# Altium project PLC_DIY.PrjPcb
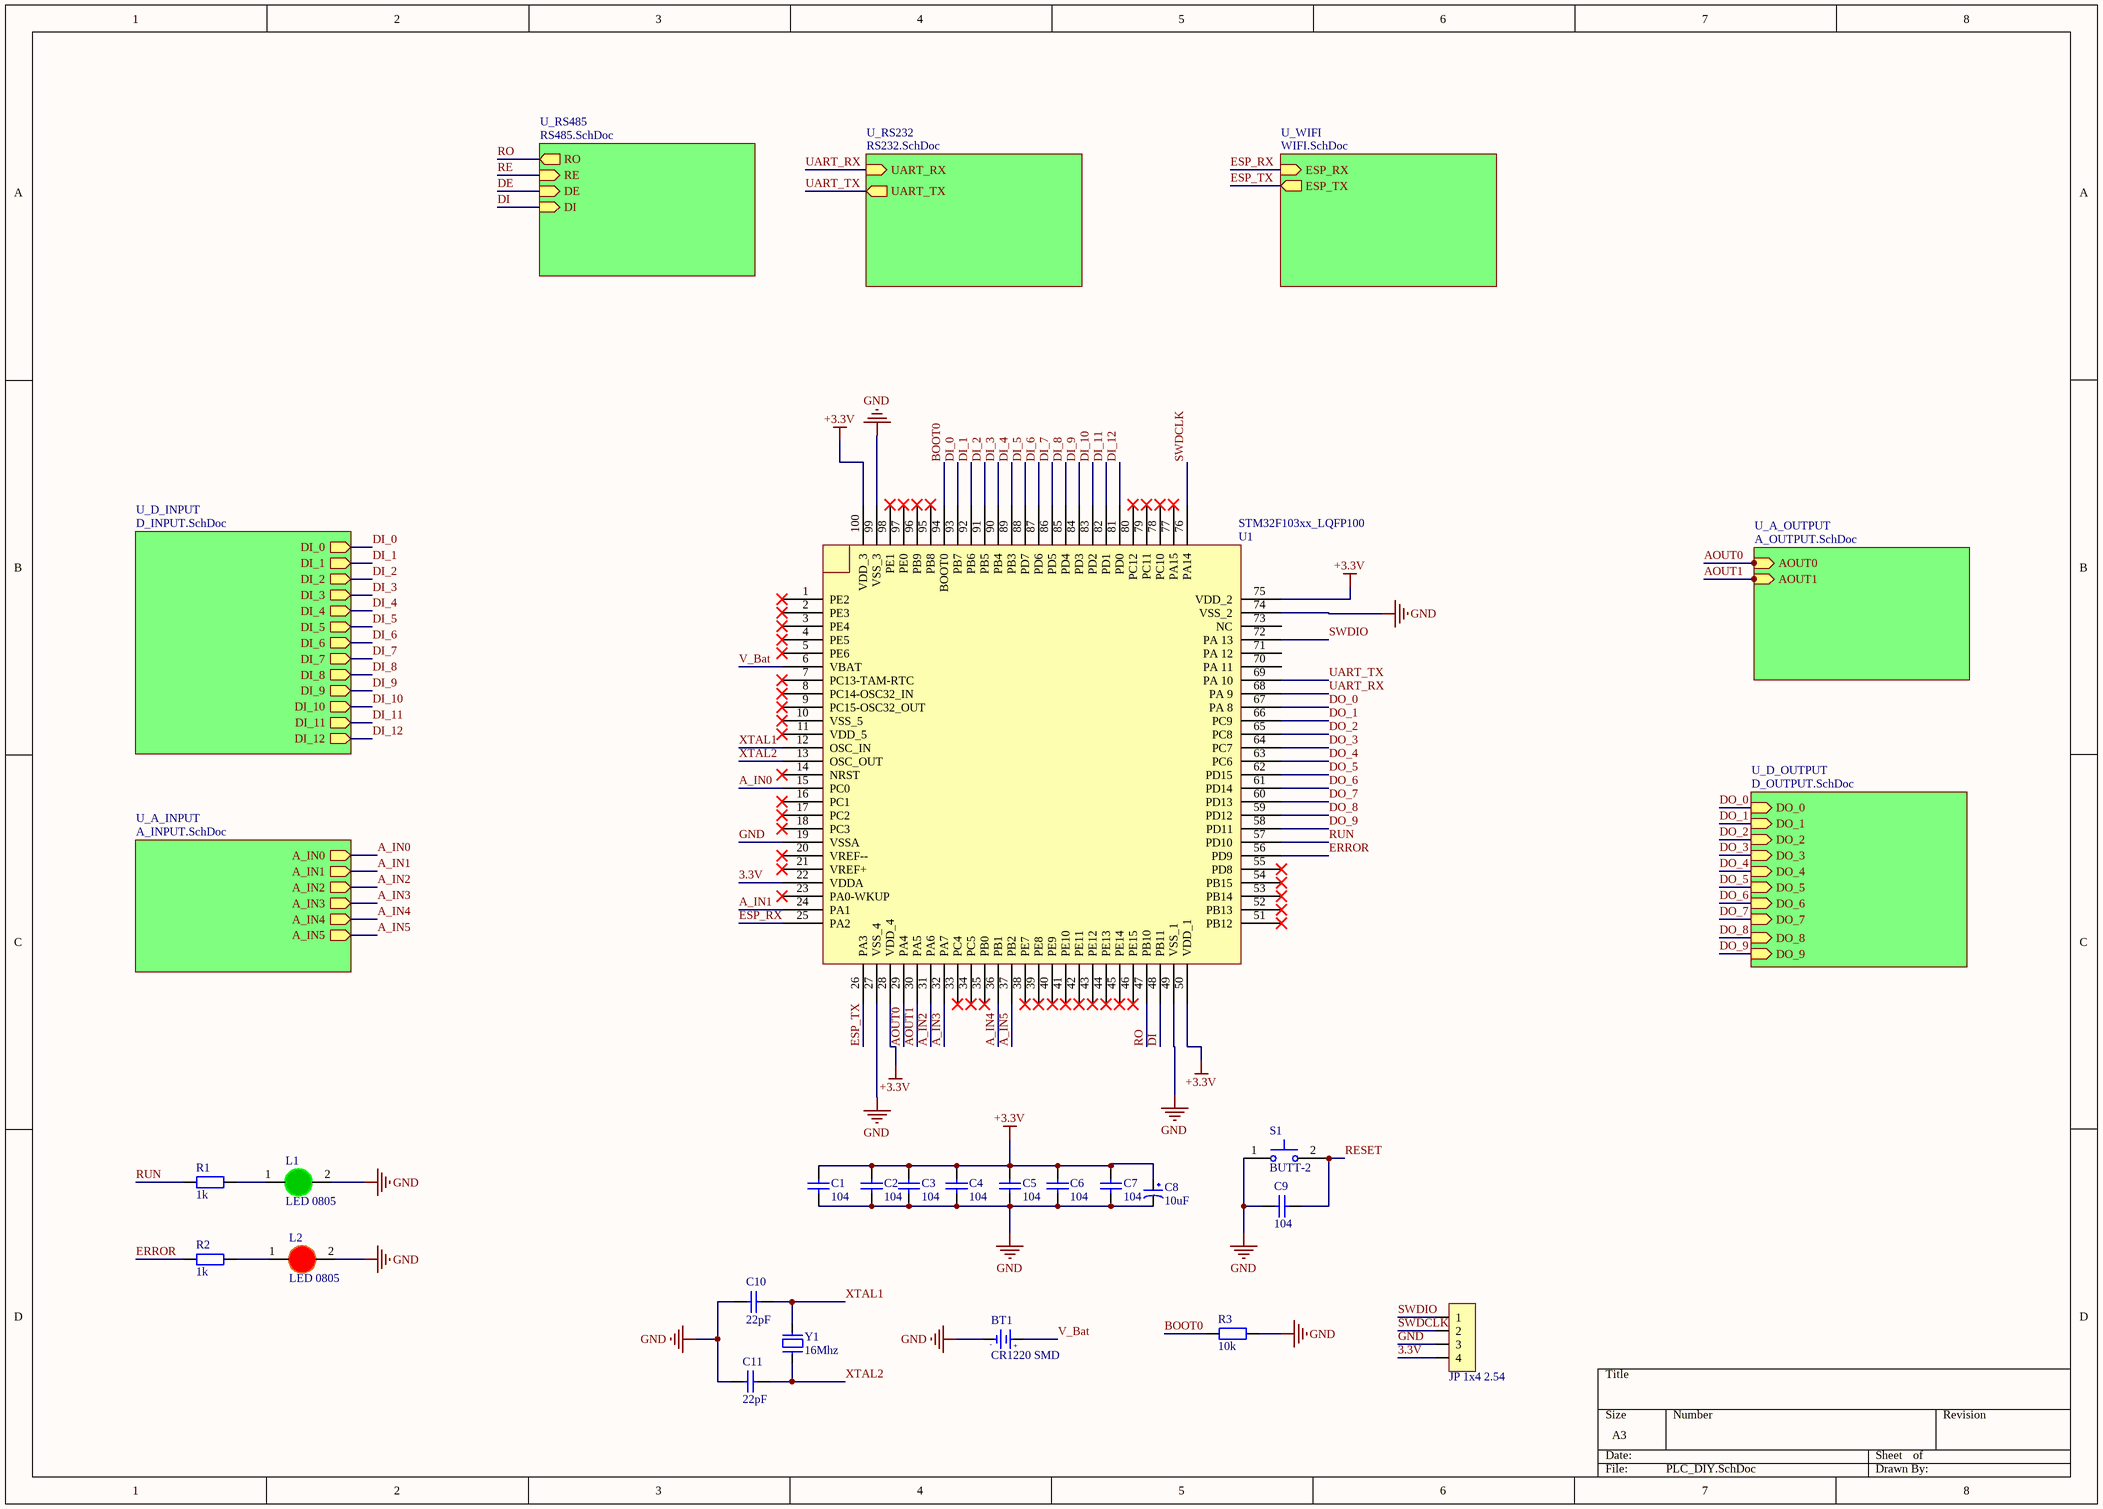
[diagram p0: PLC_DIY.SchDoc]
10 sheets, 178 parts. Net scope: hierarchical (ports join the sheet entries above them; power ports are global).
Board file: PLC_DIY.PcbDoc
Sheets:
  PLC_DIY.SchDoc
    U_A_INPUT = A_INPUT.SchDoc
    U_D_INPUT = D_INPUT.SchDoc
    U_A_OUTPUT = A_OUTPUT.SchDoc
    U_D_OUTPUT = D_OUTPUT.SchDoc
    U_RS232 = RS232.SchDoc
    U_RS485 = RS485.SchDoc
    U_WIFI = WIFI.SchDoc
  PWM_OUTPUT.SchDoc
  KHOI_NGUON.SchDoc

## Sheet PLC_DIY.SchDoc: PLC_DIY
size A3; DocumentNumber: 1; SheetNumber: 1; SheetTotal: 10

### Parts
BT1  CR1220 SMD  [DE PIN CR1220]
C1  104  [tu 0805]
C2  104  [tu 0805]
C3  104  [tu 0805]
C4  104  [tu 0805]
C5  104  [tu 0805]
C6  104  [tu 0805]
C7  104  [tu 0805]
C8  10uF  [tu tantalum smd3528]
C9  104  [tu 0805]
C10  22pF  [tu 0805]
C11  22pF  [tu 0805]
JP1  JP 1x4 2.54  [JP 1x4 DC]
L1  LED 0805  [LED-0805-Green]
L2  LED 0805  [LED-0805-Red]
R1  1k  [tro smd 0805]
R2  1k  [tro smd 0805]
R3  10k  [tro smd 0805]
S1  BUTT-2  [SW_BUTT-2]
U1  STM32F103xx_LQFP100  [STM32_LQFP100]
Y1  16Mhz  [Thach Anh 2 chan SMD]

### Sub-sheets
U_A_INPUT = A_INPUT.SchDoc: A_IN0 (out), A_IN1 (out), A_IN2 (out), A_IN3 (out), A_IN4 (out), A_IN5 (out)
U_A_OUTPUT = A_OUTPUT.SchDoc: AOUT0 (in), AOUT1 (in)
U_D_INPUT = D_INPUT.SchDoc: DI_0 (out), DI_1 (out), DI_2 (out), DI_3 (out), DI_4 (out), DI_5 (out), DI_6 (out), DI_7 (out), DI_8 (out), DI_9 (out), DI_10 (out), DI_11 (out), DI_12 (out)
U_D_OUTPUT = D_OUTPUT.SchDoc: DO_0 (in), DO_1 (in), DO_2 (in), DO_3 (in), DO_4 (in), DO_9 (in), DO_5 (in), DO_6 (in), DO_7 (in), DO_8 (in)
U_RS232 = RS232.SchDoc: UART_TX (out), UART_RX (in)
U_RS485 = RS485.SchDoc: RO (out), RE (in), DE (in), DI (in)
U_WIFI = WIFI.SchDoc: ESP_TX (out), ESP_RX (in)

### Nets
+3.3V: C1.1 C2.1 C3.1 C4.1 C5.1 C6.1 C7.1 C8.1 U1.28(VDD_4) U1.50(VDD_1) U1.75(VDD_2) U1.100(VDD_3)
GND: BT1.2(GND) C1.2 C2.2 C3.2 C4.2 C5.2 C6.2 C7.2 C8.2 C9.1 C10.2 C11.2 JP1.3 L1.2(K) L2.2(K) R3.2 S1.1 U1.19(VSSA) U1.27(VSS_4) U1.49(VSS_1) U1.74(VSS_2) U1.99(VSS_3)
3.3V: JP1.4 U1.22(VDDA)
A_IN0: U1.15(PC0) ; sheet U_A_INPUT/A_IN0
A_IN1: U1.24(PA1) ; sheet U_A_INPUT/A_IN1
A_IN2: U1.31(PA6) ; sheet U_A_INPUT/A_IN2
A_IN3: U1.32(PA7) ; sheet U_A_INPUT/A_IN3
A_IN4: U1.36(PB1) ; sheet U_A_INPUT/A_IN4
A_IN5: U1.37(PB2) ; sheet U_A_INPUT/A_IN5
AOUT0: U1.29(PA4) ; sheet U_A_OUTPUT/AOUT0
AOUT1: U1.30(PA5) ; sheet U_A_OUTPUT/AOUT1
BOOT0: R3.1 U1.94(BOOT0)
DE: U1.47(PB10) U1.48(PB11) ; sheet U_RS485/RO, sheet U_RS485/RE, sheet U_RS485/DE, sheet U_RS485/DI  [also labelled DI, RE, RO]
DI_0: U1.93(PB7) ; sheet U_D_INPUT/DI_0
DI_1: U1.92(PB6) ; sheet U_D_INPUT/DI_1
DI_2: U1.91(PB5) ; sheet U_D_INPUT/DI_2
DI_3: U1.90(PB4) ; sheet U_D_INPUT/DI_3
DI_4: U1.89(PB3) ; sheet U_D_INPUT/DI_4
DI_5: U1.88(PD7) ; sheet U_D_INPUT/DI_5
DI_6: U1.87(PD6) ; sheet U_D_INPUT/DI_6
DI_7: U1.86(PD5) ; sheet U_D_INPUT/DI_7
DI_8: U1.85(PD4) ; sheet U_D_INPUT/DI_8
DI_9: U1.84(PD3) ; sheet U_D_INPUT/DI_9
DI_10: U1.83(PD2) ; sheet U_D_INPUT/DI_10
DI_11: U1.82(PD1) ; sheet U_D_INPUT/DI_11
DI_12: U1.81(PD0) ; sheet U_D_INPUT/DI_12
DO_0: U1.67(PA_8) ; sheet U_D_OUTPUT/DO_0
DO_1: U1.66(PC9) ; sheet U_D_OUTPUT/DO_1
DO_2: U1.65(PC8) ; sheet U_D_OUTPUT/DO_2
DO_3: U1.64(PC7) ; sheet U_D_OUTPUT/DO_3
DO_4: U1.63(PC6) ; sheet U_D_OUTPUT/DO_4
DO_5: U1.62(PD15) ; sheet U_D_OUTPUT/DO_5
DO_6: U1.61(PD14) ; sheet U_D_OUTPUT/DO_6
DO_7: U1.60(PD13) ; sheet U_D_OUTPUT/DO_7
DO_8: U1.59(PD12) ; sheet U_D_OUTPUT/DO_8
DO_9: U1.58(PD11) ; sheet U_D_OUTPUT/DO_9
ERROR: R2.1 U1.56(PD9)
ESP_RX: U1.25(PA2) ; sheet U_WIFI/ESP_RX
ESP_TX: U1.26(PA3) ; sheet U_WIFI/ESP_TX
RESET: C9.2 S1.2
RUN: R1.1 U1.57(PD10)
SWDCLK: JP1.2 U1.76(PA14)
SWDIO: JP1.1 U1.72(PA_13)
UART_RX: U1.68(PA_9) ; sheet U_RS232/UART_RX
UART_TX: U1.69(PA_10) ; sheet U_RS232/UART_TX
V_Bat: BT1.1(+3V) U1.6(VBAT)
XTAL1: C10.1 U1.12(OSC_IN) Y1.2
XTAL2: C11.1 U1.13(OSC_OUT) Y1.1
NetL1_1: L1.1(A) R1.2
NetL2_1: L2.1(A) R2.2

Not connected (* = marked no-connect by the designer): U1 1(PE2)* 2(PE3)* 3(PE4)* 4(PE5)* 5(PE6)* 7(PC13-TAM-RTC)* 8(PC14-OSC32_IN)* 9(PC15-OSC32_OUT)* 10(VSS_5)* 11(VDD_5)* 14(NRST)* 16(PC1)* 17(PC2)* 18(PC3)* 20(VREF--)* 21(VREF+)* 23(PA0-WKUP)* 33(PC4)* 34(PC5)* 35(PB0)* 38(PE7)* 39(PE8)* 40(PE9)* 41(PE10)* 42(PE11)* 43(PE12)* 44(PE13)* 45(PE14)* 46(PE15)* 51(PB12)* 52(PB13)* 53(PB14)* 54(PB15)* 55(PD8)* 70(PA_11) 71(PA_12) 73(NC) 77(PA15)* 78(PC10)* 79(PC11)* 80(PC12)* 95(PB8)* 96(PB9)* 97(PE0)* 98(PE1)*

### Notes on the sheet
- (in symbol De pin CR1220 SMD) -; +

### Library data of the parts
BT1 = De pin CR1220 SMD: Ten: Đế PIN CR1220 SMD; Ma_Hang: MH000833
C1-C7 C9 = Tu 0805 104 50V 10%: Dán; Don_Vi: Con; So_Chan: 2; Ten_Linh_Kien: Tụ 0805 104-100nF 10% 50V; Ma_Hang: MH004551; Chung_Loai: Dán; Kieu_Chan: *
C8 = Tu tantalum 10uF 16V SMD3528: Dán; Don_Vi: Con; So_Chan: 2; Ten_Linh_Kien: Tụ tantalum 106C-10uF 16V SMD3528; Ma_Hang: MH007474; Chung_Loai: Dán; Kieu_Chan: *
C10 C11 = Tu 0805 22pF 50V 10%: Dán; Don_Vi: Con; So_Chan: 2; Ten_Linh_Kien: Tụ 0805 22P 10% 50V; Ma_Hang: MH004560; Chung_Loai: Dán; Kieu_Chan: *
JP1 = JP 1x4 2.54 Duc Cong: Cắm; Ten_Linh_Kien: Jump Đơn Đực 2.54MM 1x40P Cong Đứng; Don_Vi: Con; Ma_Hang: MH000904; Ghi_Chu: *; Kieu_Chan: *; Chung_Loai: Cắm
L1 = LED 0805 Xanh La: Dán; Don_Vi: Con; Ma_Hang: MH002326; Ten_Linh_Kien: LED 0805 Màu Xanh Lá (Green); Ghi_Chu: *; Kieu_Chan: *; Chung_Loai: Dán
L2 = LED 0805 Do: Dán; Don_Vi: Con; Ma_Hang: MH000897; Ten_Linh_Kien: LED 0805 Màu Đỏ (Red); Ghi_Chu: *; Kieu_Chan: *; Chung_Loai: Dán
R1 R2 = Tro 0805 1% 1k: Dán; Don_Vi: Con; So_Chan: 2; Ten_Linh_Kien: Trở 0805 1% 1k; Ma_Hang: MH005468; Chung_Loai: Dán; Kieu_Chan: *
R3 = Tro 0805 1% 10k: Dán; Don_Vi: Con; So_Chan: 2; Ten_Linh_Kien: Trở 0805 1% 10k; Ma_Hang: MH005473; Chung_Loai: Dán; Kieu_Chan: *
S1 = BUTT-2: Tactile Switches MINI PUSH BUTTON SWITCH 2-PIN QTY. 4; MF: Gravitech; Purchase-URL: https://pricing.snapeda.com/search/part/BUTT-2/?ref=eda; Package: None; Value: *; Check_prices: https://www.snapeda.com/parts/BUTT-2/Gravitech/view-part/?ref=eda; SnapEDA_Link: https://www.snapeda.com/parts/BUTT-2/Gravitech/view-part/?ref=snap; Availability: In Stock; Price: None; MP: BUTT-2
Y1 = Thach Anh 2 chan SMD: Crystal For all Crystal 2pin.; Value: 4Mhz

## Sheet A_INPUT.SchDoc
size A3; SheetNumber: 3; SheetTotal: 10
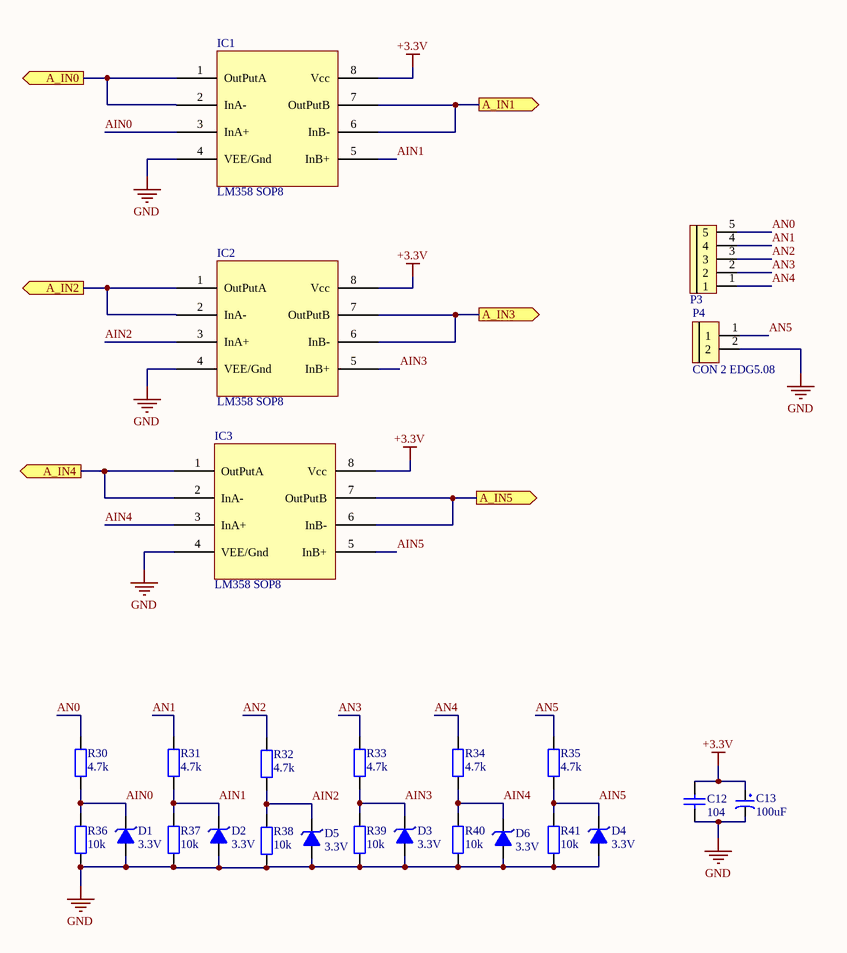
[diagram p1: A_INPUT.SchDoc]

### Parts
C12  104  [tu 0805]
C13  100uF  [tu hoa 5mm]
D1  3.3V  [DIODE ZENNER SMD SOD80]
D2  3.3V  [DIODE ZENNER SMD SOD80]
D3  3.3V  [DIODE ZENNER SMD SOD80]
D4  3.3V  [DIODE ZENNER SMD SOD80]
D5  3.3V  [DIODE ZENNER SMD SOD80]
D6  3.3V  [DIODE ZENNER SMD SOD80]
IC1  LM358 SOP8  [SOP 8]
IC2  LM358 SOP8  [SOP 8]
IC3  LM358 SOP8  [SOP 8]
P3  CON 5 EDG5.08  [CON 5 5EDG5.08]  (value not drawn)
P4  CON 2 EDG5.08  [CON 2 2EDG5.08]
R30  4.7k  [tro smd 0805]
R31  4.7k  [tro smd 0805]
R32  4.7k  [tro smd 0805]
R33  4.7k  [tro smd 0805]
R34  4.7k  [tro smd 0805]
R35  4.7k  [tro smd 0805]
R36  10k  [tro smd 0805]
R37  10k  [tro smd 0805]
R38  10k  [tro smd 0805]
R39  10k  [tro smd 0805]
R40  10k  [tro smd 0805]
R41  10k  [tro smd 0805]

### Ports
A_IN0 (out), A_IN1 (out), A_IN2 (out), A_IN3 (out), A_IN4 (out), A_IN5 (out)

### Nets
+3.3V: C12.1 C13.1 IC1.8(Vcc) IC2.8(Vcc) IC3.8(Vcc)
GND: C12.2 C13.2 D1.1(A) D2.1(A) D3.1(A) D4.1(A) D5.1(A) D6.1(A) IC1.4(VEE/Gnd) IC2.4(VEE/Gnd) IC3.4(VEE/Gnd) P4.2 R36.1 R37.1 R38.1 R39.1 R40.1 R41.1
A_IN0: IC1.1(OutPutA) IC1.2(InA-) ; port A_IN0
A_IN1: IC1.6(InB-) IC1.7(OutPutB) ; port A_IN1
A_IN2: IC2.1(OutPutA) IC2.2(InA-) ; port A_IN2
A_IN3: IC2.6(InB-) IC2.7(OutPutB) ; port A_IN3
A_IN4: IC3.1(OutPutA) IC3.2(InA-) ; port A_IN4
A_IN5: IC3.6(InB-) IC3.7(OutPutB) ; port A_IN5
AIN0: D1.2(K) IC1.3(InA+) R30.1 R36.2
AIN1: D2.2(K) IC1.5(InB+) R31.1 R37.2
AIN2: D5.2(K) IC2.3(InA+) R32.1 R38.2
AIN3: D3.2(K) IC2.5(InB+) R33.1 R39.2
AIN4: D6.2(K) IC3.3(InA+) R34.1 R40.2
AIN5: D4.2(K) IC3.5(InB+) R35.1 R41.2
AN0: P3.5 R30.2
AN1: P3.4 R31.2
AN2: P3.3 R32.2
AN3: P3.2 R33.2
AN4: P3.1 R34.2
AN5: P4.1 R35.2

### Library data of the parts
C12 = Tu 0805 104 50V 10%: as C1 on sheet PLC_DIY; Chung_Loai: Dán; Kieu_Chan: *
C13 = Tu Hoa 100uF 16V 5x7: Cắm; Don_Vi: Con; So_Chan: 2; Ten_Linh_Kien: Tụ Hóa 100uF 16V 5x7MM; Ma_Hang: MH001347; Chung_Loai: Cắm; Kieu_Chan: *
D1-D6 = Diode Zener 3.3V: Dán; Don_Vi: Con; Ma_Hang: MH002880; Ten_Linh_Kien: Diode Zener 1/2W 3.3V SMD1206 ZMM3.3; Kieu_Chan: *; Ghi_Chu: *; Chung_Loai: Dán
IC1-IC3 = LM358 SOP8: Dán; Ma_Hang: MH000609; Don_Vi: Con; Ten_Linh_Kien: LM358 SOP8; Kieu_Chan: *; Ghi_Chu: *; Chung_Loai: Dán
P3 = CON 5 EDG5.08: Cắm; Ten_Linh_Kien: CON 5 2EDG5.08-5P 5.08MM ( Xanh Cong); Ma_Hang: MH003589; Kieu_Chan: *; Don_Vi: Con; Ghi_Chu: *; Chung_Loai: Cắm
P4 = CON 2 EDG5.08: Cắm; Ten_Linh_Kien: CON 2 2EDG5.08-2P 5.08MM ( Xanh Cong); Ma_Hang: MH000759; Ghi_Chu: *; Don_Vi: Con; Kieu_Chan: *; Chung_Loai: Cắm
R30-R35 = Tro 0805 1% 5.1k: Dán; Don_Vi: Con; So_Chan: 2; Ten_Linh_Kien: Trở 0805 1% 5.1k; Ma_Hang: MH008812; Chung_Loai: Dán; Kieu_Chan: *
R36-R41 = Tro 0805 1% 10k: as R3 on sheet PLC_DIY; Chung_Loai: Dán; Kieu_Chan: *

## Sheet D_INPUT.SchDoc
size A3; SheetNumber: 2; SheetTotal: 10
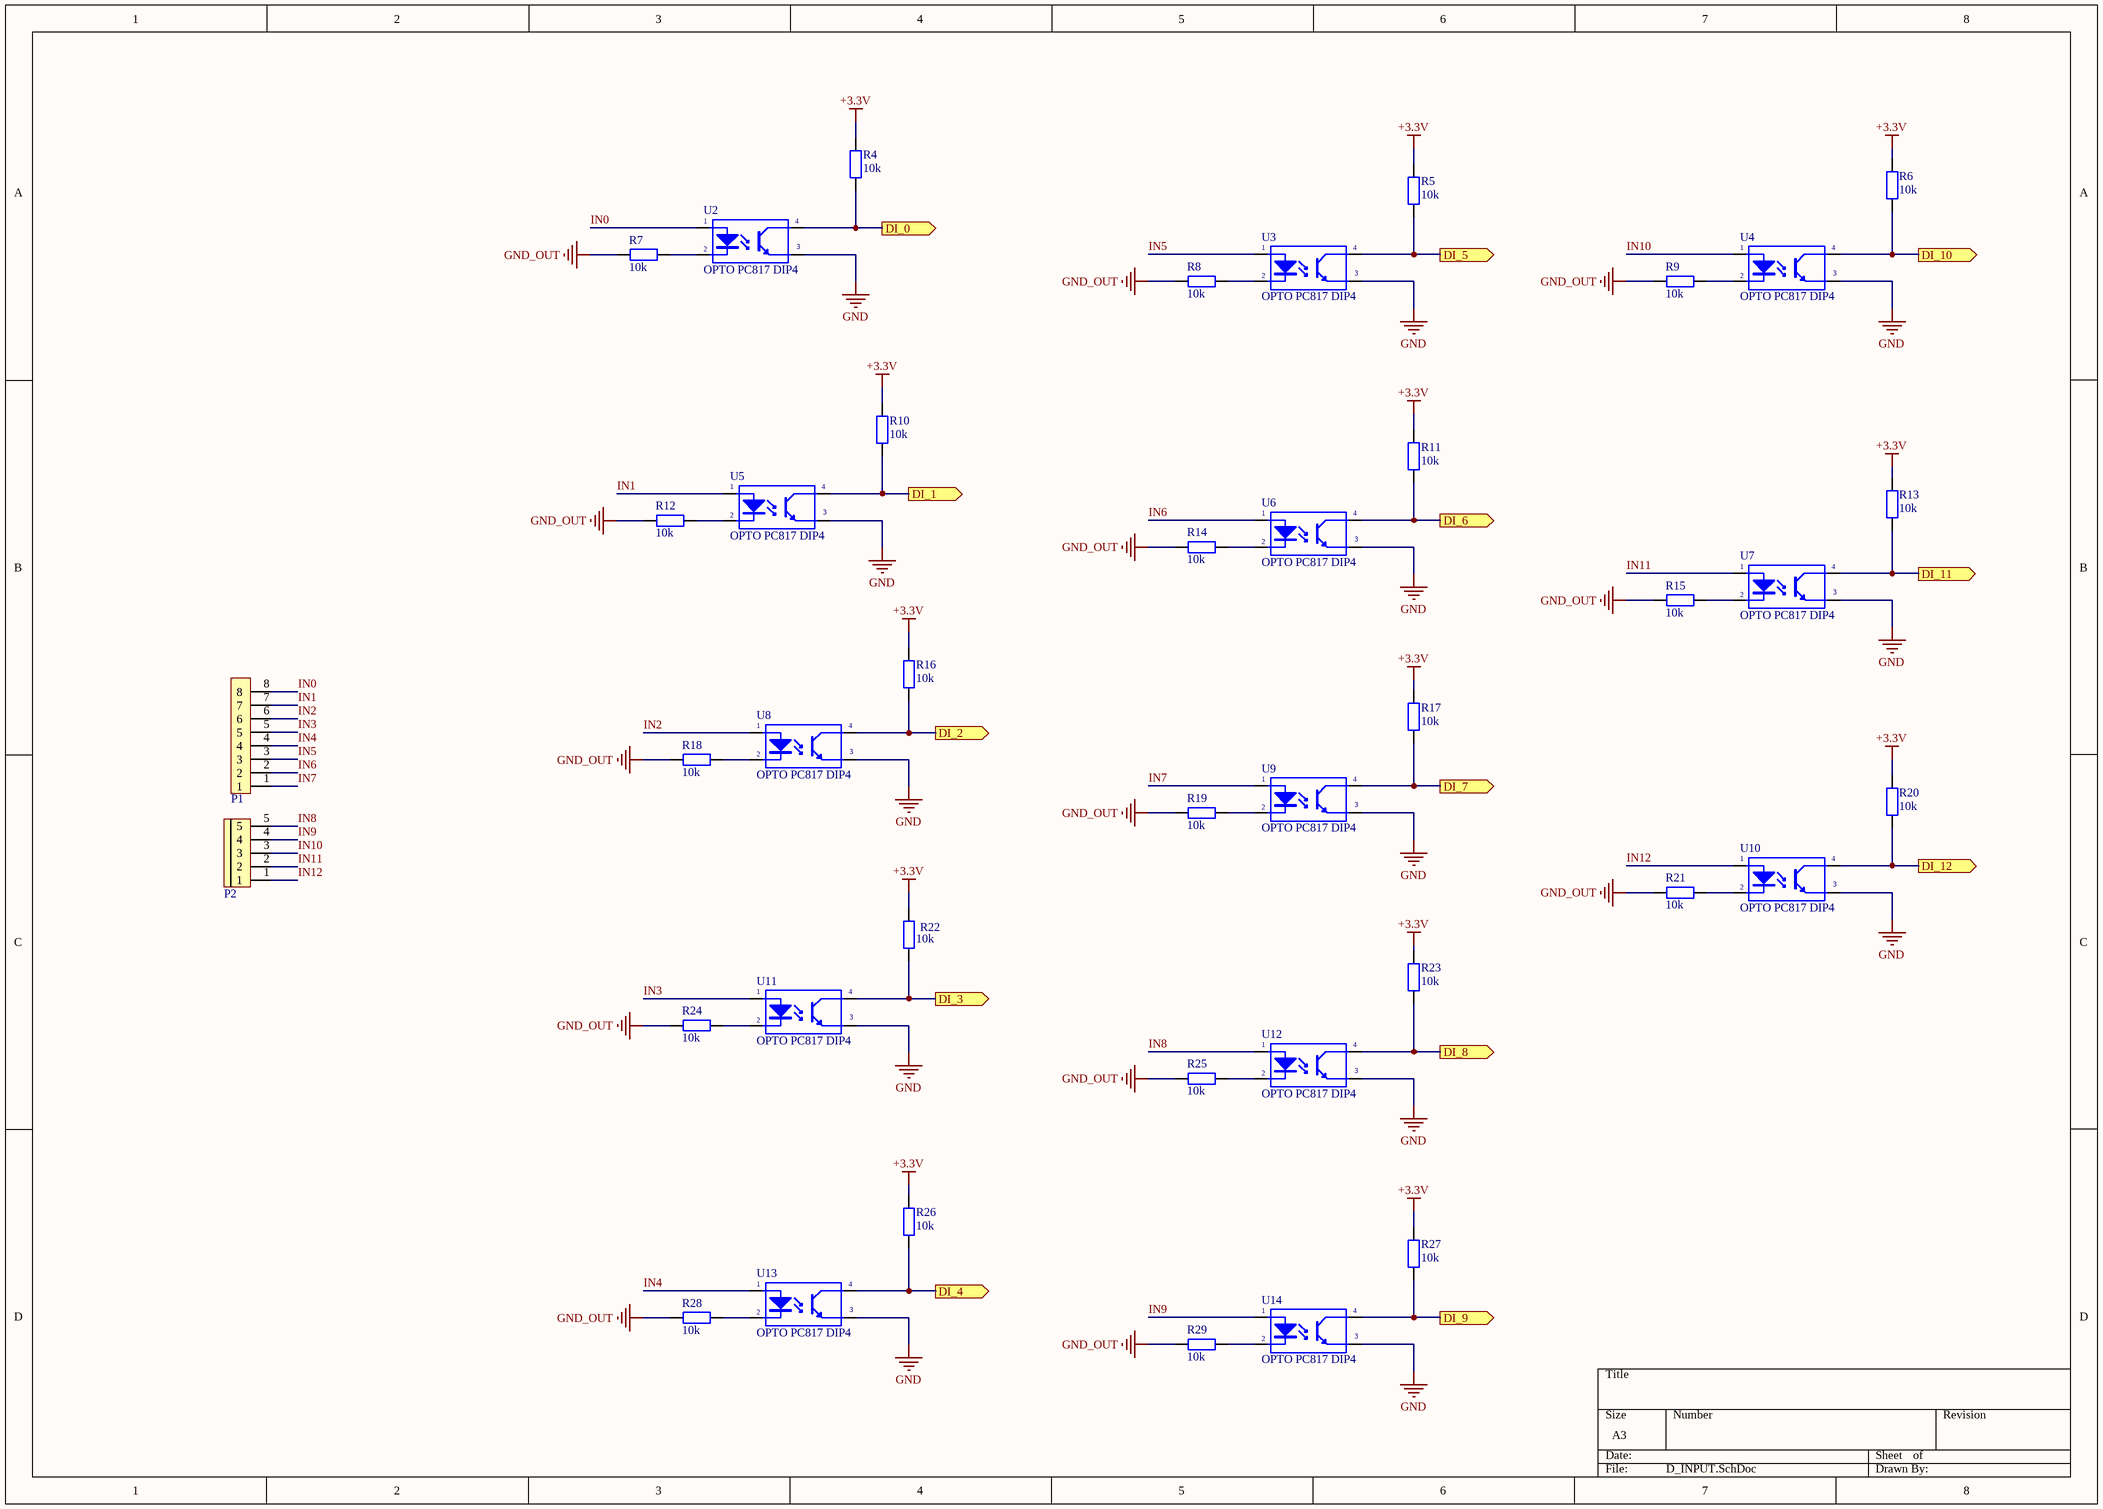
[diagram p2: D_INPUT.SchDoc]

### Parts
P1  CON 8 EDG5.08  [CON 8 8EDG5.08]  (value not drawn)
P2  CON 5 EDG5.08  [CON 5 5EDG5.08]  (value not drawn)
R4  10k  [tro smd 0805]
R5  10k  [tro smd 0805]
R6  10k  [tro smd 0805]
R7  10k  [tro smd 0805]
R8  10k  [tro smd 0805]
R9  10k  [tro smd 0805]
R10  10k  [tro smd 0805]
R11  10k  [tro smd 0805]
R12  10k  [tro smd 0805]
R13  10k  [tro smd 0805]
R14  10k  [tro smd 0805]
R15  10k  [tro smd 0805]
R16  10k  [tro smd 0805]
R17  10k  [tro smd 0805]
R18  10k  [tro smd 0805]
R19  10k  [tro smd 0805]
R20  10k  [tro smd 0805]
R21  10k  [tro smd 0805]
R22  10k  [tro smd 0805]
R23  10k  [tro smd 0805]
R24  10k  [tro smd 0805]
R25  10k  [tro smd 0805]
R26  10k  [tro smd 0805]
R27  10k  [tro smd 0805]
R28  10k  [tro smd 0805]
R29  10k  [tro smd 0805]
U2  OPTO PC817 DIP4  [DIP4]
U3  OPTO PC817 DIP4  [DIP4]
U4  OPTO PC817 DIP4  [DIP4]
U5  OPTO PC817 DIP4  [DIP4]
U6  OPTO PC817 DIP4  [DIP4]
U7  OPTO PC817 DIP4  [DIP4]
U8  OPTO PC817 DIP4  [DIP4]
U9  OPTO PC817 DIP4  [DIP4]
U10  OPTO PC817 DIP4  [DIP4]
U11  OPTO PC817 DIP4  [DIP4]
U12  OPTO PC817 DIP4  [DIP4]
U13  OPTO PC817 DIP4  [DIP4]
U14  OPTO PC817 DIP4  [DIP4]

### Ports
DI_0 (out), DI_1 (out), DI_2 (out), DI_3 (out), DI_4 (out), DI_5 (out), DI_6 (out), DI_7 (out), DI_8 (out), DI_9 (out), DI_10 (out), DI_11 (out), DI_12 (out)

### Nets
+3.3V: R4.2 R5.2 R6.2 R10.2 R11.2 R13.2 R16.2 R17.2 R20.2 R22.2 R23.2 R26.2 R27.2
GND: U2.3(E) U3.3(E) U4.3(E) U5.3(E) U6.3(E) U7.3(E) U8.3(E) U9.3(E) U10.3(E) U11.3(E) U12.3(E) U13.3(E) U14.3(E)
GND_OUT: R7.1 R8.1 R9.1 R12.1 R14.1 R15.1 R18.1 R19.1 R21.1 R24.1 R25.1 R28.1 R29.1
DI_0: R4.1 U2.4(C) ; port DI_0
DI_1: R10.1 U5.4(C) ; port DI_1
DI_2: R16.1 U8.4(C) ; port DI_2
DI_3: R22.1 U11.4(C) ; port DI_3
DI_4: R26.1 U13.4(C) ; port DI_4
DI_5: R5.1 U3.4(C) ; port DI_5
DI_6: R11.1 U6.4(C) ; port DI_6
DI_7: R17.1 U9.4(C) ; port DI_7
DI_8: R23.1 U12.4(C) ; port DI_8
DI_9: R27.1 U14.4(C) ; port DI_9
DI_10: R6.1 U4.4(C) ; port DI_10
DI_11: R13.1 U7.4(C) ; port DI_11
DI_12: R20.1 U10.4(C) ; port DI_12
IN0: P1.8 U2.1(A)
IN1: P1.7 U5.1(A)
IN2: P1.6 U8.1(A)
IN3: P1.5 U11.1(A)
IN4: P1.4 U13.1(A)
IN5: P1.3 U3.1(A)
IN6: P1.2 U6.1(A)
IN7: P1.1 U9.1(A)
IN8: P2.5 U12.1(A)
IN9: P2.4 U14.1(A)
IN10: P2.3 U4.1(A)
IN11: P2.2 U7.1(A)
IN12: P2.1 U10.1(A)
NetR7_2: R7.2 U2.2(K)
NetR8_2: R8.2 U3.2(K)
NetR9_2: R9.2 U4.2(K)
NetR12_2: R12.2 U5.2(K)
NetR14_2: R14.2 U6.2(K)
NetR15_2: R15.2 U7.2(K)
NetR18_2: R18.2 U8.2(K)
NetR19_2: R19.2 U9.2(K)
NetR21_2: R21.2 U10.2(K)
NetR24_2: R24.2 U11.2(K)
NetR25_2: R25.2 U12.2(K)
NetR28_2: R28.2 U13.2(K)
NetR29_2: R29.2 U14.2(K)

### Library data of the parts
P1 = CON 8 EDG5.08: Cắm; Ten_Linh_Kien: CON 8 2EDG5.08-8P 5.08MM ( Xanh Cong); Ma_Hang: MH000978; Don_Vi: Con; Ghi_Chu: *; Kieu_Chan: *; Chung_Loai: Cắm
P2 = CON 5 EDG5.08: as P3 on sheet A_INPUT; Kieu_Chan: *; Don_Vi: Con; Ghi_Chu: *; Chung_Loai: Cắm
R4-R29 = Tro 0805 1% 10k: as R3 on sheet PLC_DIY; Chung_Loai: Dán; Kieu_Chan: *
U2-U14 = OPTO PC817 DIP4: Single Opto; Value: PC817

## Sheet A_OUTPUT.SchDoc
size A3; SheetNumber: 8; SheetTotal: 10
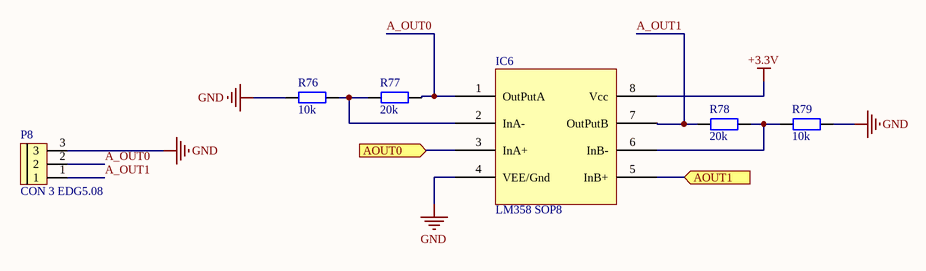
[diagram p3: A_OUTPUT.SchDoc]

### Parts
IC6  LM358 SOP8  [SOP 8]
P8  CON 3 EDG5.08  [CON 3 3EDG5.08]
R76  10k  [tro smd 0805]
R77  20k  [tro smd 0805]
R78  20k  [tro smd 0805]
R79  10k  [tro smd 0805]

### Ports
AOUT0 (in), AOUT1 (in)

### Nets
+3.3V: IC6.8(Vcc)
GND: IC6.4(VEE/Gnd) P8.3 R76.1 R79.1
A_OUT0: IC6.1(OutPutA) P8.2 R77.2
A_OUT1: IC6.7(OutPutB) P8.1 R78.2
AOUT0: IC6.3(InA+) ; port AOUT0
AOUT1: IC6.5(InB+) ; port AOUT1
NetIC6_2: IC6.2(InA-) R76.2 R77.1
NetIC6_6: IC6.6(InB-) R78.1 R79.2

### Library data of the parts
IC6 = LM358 SOP8: Dán; Ma_Hang: MH000609; Don_Vi: Con; Ten_Linh_Kien: LM358 SOP8; Kieu_Chan: *; Ghi_Chu: *; Chung_Loai: Dán
P8 = CON 3 EDG5.08: Cắm; Ten_Linh_Kien: CON 3 2EDG5.08-3P 5.08MM ( Xanh Cong); Ma_Hang: MH000760; Ghi_Chu: *; Kieu_Chan: *; Don_Vi: Con; Chung_Loai: Cắm
R76-R79 = Tro 0805 1% 10k: as R3 on sheet PLC_DIY; Chung_Loai: Dán; Kieu_Chan: *

## Sheet D_OUTPUT.SchDoc
size A3; SheetNumber: 4; SheetTotal: 10
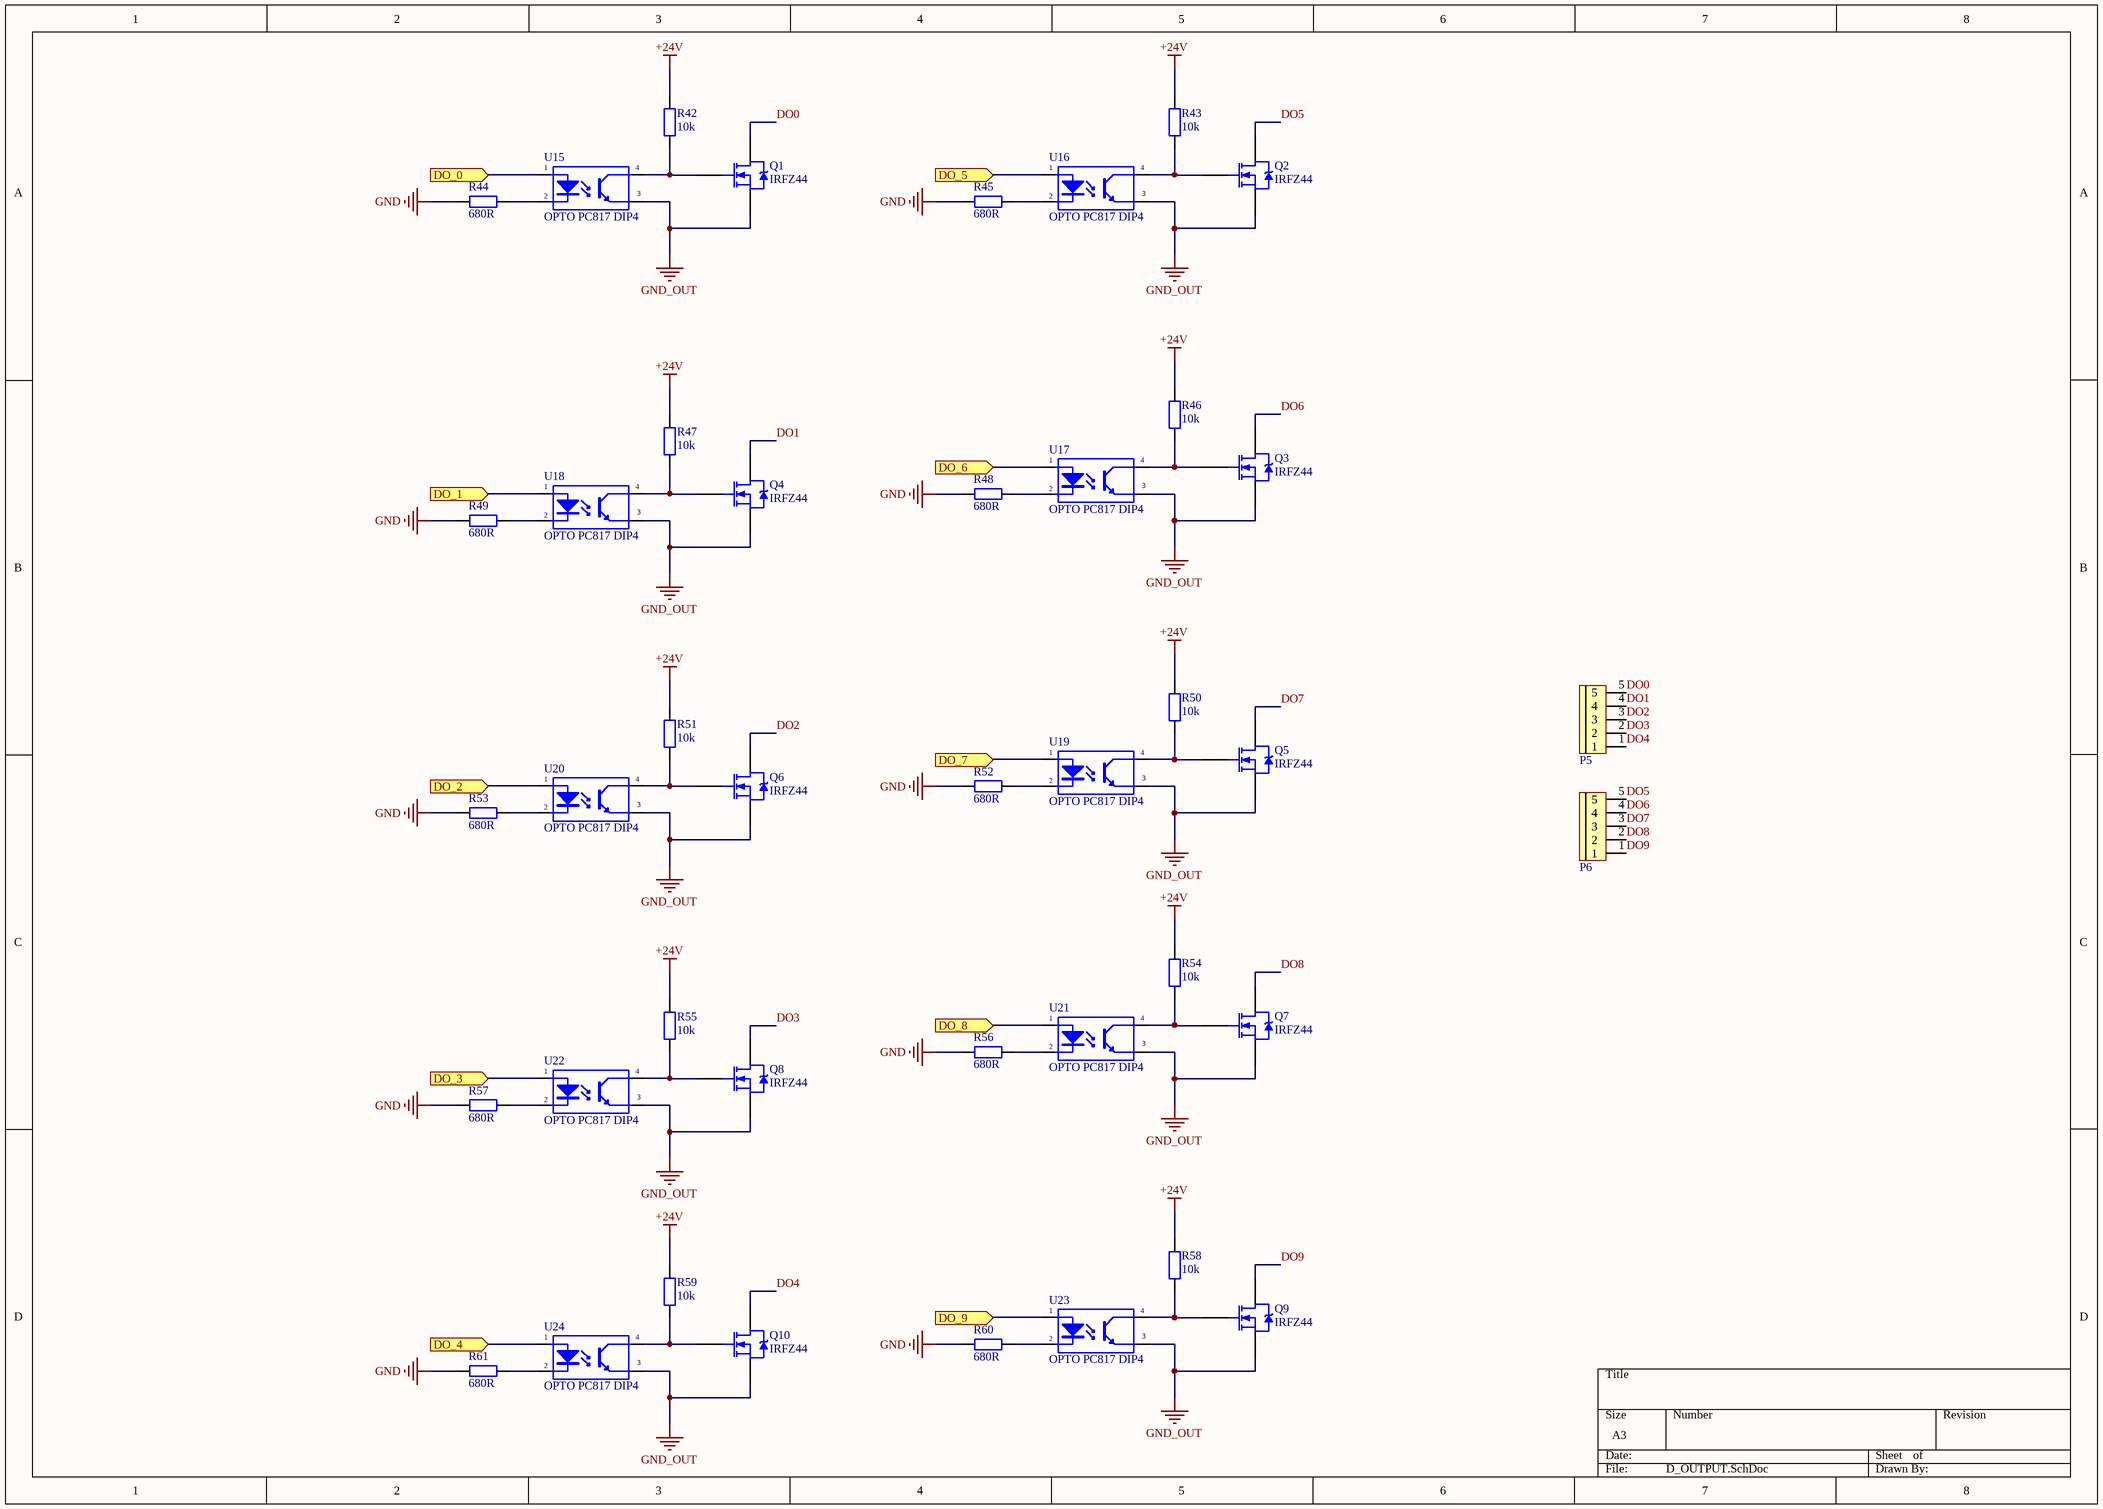
[diagram p4: D_OUTPUT.SchDoc]

### Parts
P5  CON 5 EDG5.08  [CON 5 5EDG5.08]  (value not drawn)
P6  CON 5 EDG5.08  [CON 5 5EDG5.08]  (value not drawn)
Q1  IRFZ44  [TO220]
Q2  IRFZ44  [TO220]
Q3  IRFZ44  [TO220]
Q4  IRFZ44  [TO220]
Q5  IRFZ44  [TO220]
Q6  IRFZ44  [TO220]
Q7  IRFZ44  [TO220]
Q8  IRFZ44  [TO220]
Q9  IRFZ44  [TO220]
Q10  IRFZ44  [TO220]
R42  10k  [tro smd 0805]
R43  10k  [tro smd 0805]
R44  680R  [tro smd 0805]
R45  680R  [tro smd 0805]
R46  10k  [tro smd 0805]
R47  10k  [tro smd 0805]
R48  680R  [tro smd 0805]
R49  680R  [tro smd 0805]
R50  10k  [tro smd 0805]
R51  10k  [tro smd 0805]
R52  680R  [tro smd 0805]
R53  680R  [tro smd 0805]
R54  10k  [tro smd 0805]
R55  10k  [tro smd 0805]
R56  680R  [tro smd 0805]
R57  680R  [tro smd 0805]
R58  10k  [tro smd 0805]
R59  10k  [tro smd 0805]
R60  680R  [tro smd 0805]
R61  680R  [tro smd 0805]
U15  OPTO PC817 DIP4  [DIP4]
U16  OPTO PC817 DIP4  [DIP4]
U17  OPTO PC817 DIP4  [DIP4]
U18  OPTO PC817 DIP4  [DIP4]
U19  OPTO PC817 DIP4  [DIP4]
U20  OPTO PC817 DIP4  [DIP4]
U21  OPTO PC817 DIP4  [DIP4]
U22  OPTO PC817 DIP4  [DIP4]
U23  OPTO PC817 DIP4  [DIP4]
U24  OPTO PC817 DIP4  [DIP4]

### Ports
DO_0 (in), DO_1 (in), DO_2 (in), DO_3 (in), DO_4 (in), DO_5 (in), DO_6 (in), DO_7 (in), DO_8 (in), DO_9 (in)

### Nets
+24V: R42.2 R43.2 R46.2 R47.2 R50.2 R51.2 R54.2 R55.2 R58.2 R59.2
GND: R44.1 R45.1 R48.1 R49.1 R52.1 R53.1 R56.1 R57.1 R60.1 R61.1
GND_OUT: Q1.3(S) Q2.3(S) Q3.3(S) Q4.3(S) Q5.3(S) Q6.3(S) Q7.3(S) Q8.3(S) Q9.3(S) Q10.3(S) U15.3(E) U16.3(E) U17.3(E) U18.3(E) U19.3(E) U20.3(E) U21.3(E) U22.3(E) U23.3(E) U24.3(E)
DO0: P5.5 Q1.2(D)
DO1: P5.4 Q4.2(D)
DO2: P5.3 Q6.2(D)
DO3: P5.2 Q8.2(D)
DO4: P5.1 Q10.2(D)
DO5: P6.5 Q2.2(D)
DO6: P6.4 Q3.2(D)
DO7: P6.3 Q5.2(D)
DO8: P6.2 Q7.2(D)
DO9: P6.1 Q9.2(D)
DO_0: U15.1(A) ; port DO_0
DO_1: U18.1(A) ; port DO_1
DO_2: U20.1(A) ; port DO_2
DO_3: U22.1(A) ; port DO_3
DO_4: U24.1(A) ; port DO_4
DO_5: U16.1(A) ; port DO_5
DO_6: U17.1(A) ; port DO_6
DO_7: U19.1(A) ; port DO_7
DO_8: U21.1(A) ; port DO_8
DO_9: U23.1(A) ; port DO_9
NetQ1_1: Q1.1(G) R42.1 U15.4(C)
NetQ2_1: Q2.1(G) R43.1 U16.4(C)
NetQ3_1: Q3.1(G) R46.1 U17.4(C)
NetQ4_1: Q4.1(G) R47.1 U18.4(C)
NetQ5_1: Q5.1(G) R50.1 U19.4(C)
NetQ6_1: Q6.1(G) R51.1 U20.4(C)
NetQ7_1: Q7.1(G) R54.1 U21.4(C)
NetQ8_1: Q8.1(G) R55.1 U22.4(C)
NetQ9_1: Q9.1(G) R58.1 U23.4(C)
NetQ10_1: Q10.1(G) R59.1 U24.4(C)
NetR44_2: R44.2 U15.2(K)
NetR45_2: R45.2 U16.2(K)
NetR48_2: R48.2 U17.2(K)
NetR49_2: R49.2 U18.2(K)
NetR52_2: R52.2 U19.2(K)
NetR53_2: R53.2 U20.2(K)
NetR56_2: R56.2 U21.2(K)
NetR57_2: R57.2 U22.2(K)
NetR60_2: R60.2 U23.2(K)
NetR61_2: R61.2 U24.2(K)

### Library data of the parts
P5 P6 = CON 5 EDG5.08: as P3 on sheet A_INPUT; Kieu_Chan: *; Don_Vi: Con; Ghi_Chu: *; Chung_Loai: Cắm
Q1-Q10 = FET IRFZ44 DIP: TO-220
R42 R43 R46 R47 R50 R51 R54 R55 R58 R59 = Tro 0805 1% 10k: as R3 on sheet PLC_DIY; Chung_Loai: Dán; Kieu_Chan: *
R44 R45 R48 R49 R52 R53 R56 R57 R60 R61 = Tro 0805 1% 680R: Dán; Don_Vi: Con; So_Chan: 2; Ten_Linh_Kien: Trở 0805 1% 680R; Ma_Hang: MH005487; Chung_Loai: Dán; Kieu_Chan: *
U15-U24 = OPTO PC817 DIP4: Single Opto; Value: PC817

## Sheet RS232.SchDoc
size A3; SheetNumber: 5; SheetTotal: 10
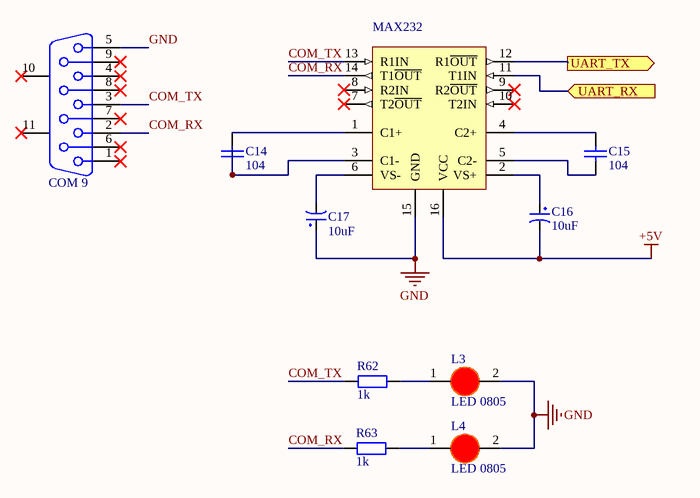
[diagram p5: RS232.SchDoc]

### Parts
C14  104  [tu 0805]
C15  104  [tu 0805]
C16  10uF  [tu hoa 4mm]
C17  10uF  [tu hoa 4mm]
COM1  COM 9  [DSB 9-F]
IC4  MAX232  [MAX-232]
L3  LED 0805  [LED-0805-Red]
L4  LED 0805  [LED-0805-Red]
R62  1k  [tro smd 0805]
R63  1k  [tro smd 0805]

### Ports
UART_RX (in), UART_TX (out)

### Nets
+5V: C16.2 IC4.16(VCC)
GND: C17.1 COM1.5 IC4.15(GND) L3.2(K) L4.2(K)
COM_RX: COM1.2 IC4.14(T1~{OUT}) R63.1
COM_TX: COM1.3 IC4.13(R1IN) R62.1
UART_RX: IC4.11(T1IN) ; port UART_RX
UART_TX: IC4.12(R1~{OUT}) ; port UART_TX
NetC14_1: C14.1 IC4.1(C1+)
NetC14_2: C14.2 IC4.3(C1-)
NetC15_1: C15.1 IC4.4(C2+)
NetC15_2: C15.2 IC4.5(C2-)
NetC16_1: C16.1 IC4.2(VS+)
NetC17_2: C17.2 IC4.6(VS-)
NetL3_1: L3.1(A) R62.2
NetL4_1: L4.1(A) R63.2

Not connected (* = marked no-connect by the designer): COM1 1* 4* 6* 7* 8* 9* 10(MH1)* 11(MH2)*; IC4 7(T2~{OUT})* 8(R2IN)* 9(R2~{OUT})* 10(T2IN)*

### Library data of the parts
C14 C15 = Tu 0805 104 50V 10%: as C1 on sheet PLC_DIY; Chung_Loai: Dán; Kieu_Chan: *
C16 C17 = Tu Hoa 10uF 25V 4x7: Cắm; So_Chan: 2; Ten_Linh_Kien: Tụ Hóa 10uF 25V 4x7MM; Don_Vi: Con; Ma_Hang: MH001349; Chung_Loai: Cắm; Kieu_Chan: *
COM1 = COM 9 DSB: PackageDocument: O; Positions: 9; Gender: Receptacle; Published: 15-Jun-2001; LatestRevisionDate: 17-Jul-2002; LatestRevisionNote: Re-released for DXP Platform.; DatasheetDocument: 1-Sep-1999; PackageReference: 788750; Publisher: Altium Limited; Orientation: Right Angle; Value: COM 9
IC4 = MAX232: Dual EIA-232 Driver/Receiver; Value: MAX232
L3 L4 = LED 0805 Do: as L2 on sheet PLC_DIY; Ghi_Chu: *; Kieu_Chan: *; Chung_Loai: Dán
R62 R63 = Tro 0805 1% 1k: as R1 on sheet PLC_DIY; Chung_Loai: Dán; Kieu_Chan: *

## Sheet RS485.SchDoc
size A3; SheetNumber: 6; SheetTotal: 10
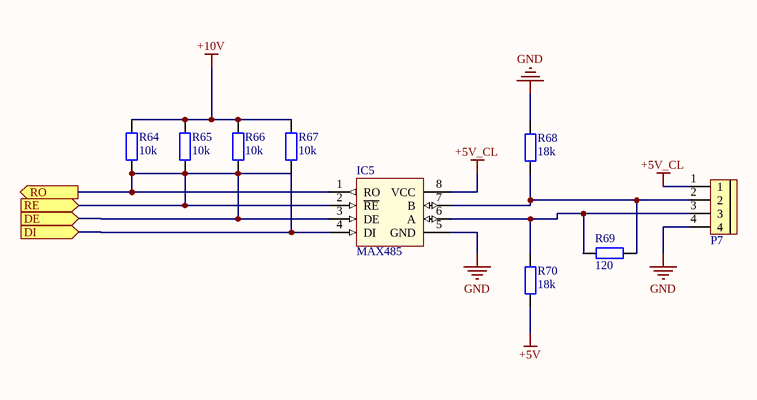
[diagram p6: RS485.SchDoc]

### Parts
IC5  MAX485  [SO-8N]
P7  CON 4 EDG5.08  [CON 4 4EDG5.08]  (value not drawn)
R64  10k  [tro smd 0805]
R65  10k  [tro smd 0805]
R66  10k  [tro smd 0805]
R67  10k  [tro smd 0805]
R68  18k  [tro smd 0805]
R69  120  [tro smd 0805]
R70  18k  [tro smd 0805]

### Ports
DE (in), DI (in), RE (in), RO (out)

### Nets
+5V: R70.1
+5V_CL: IC5.8(VCC) P7.1
+10V: R64.2 R65.2 R66.2 R67.2
GND: IC5.5(GND) P7.4 R68.2
DE: IC5.1(RO) IC5.2(~{RE}) IC5.3(DE) IC5.4(DI) R64.1 R65.1 R66.1 R67.1 ; port RO, port RE, port DE, port DI
NetIC5_6: IC5.6(A) P7.3 R69.1 R70.2
NetIC5_7: IC5.7(B) P7.2 R68.1 R69.2

### Library data of the parts
IC5 = MAX485: RS232 - RS485 (Same sn75176)
P7 = CON 4 EDG5.08: Cắm; Ten_Linh_Kien: CON 4 2EDG5.08-4P 5.08MM ( Xanh Cong); Ma_Hang: MH000979; Don_Vi: Con; Ghi_Chu: *; Kieu_Chan: *; Chung_Loai: Cắm
R64-R67 = Tro 0805 1% 10k: as R3 on sheet PLC_DIY; Chung_Loai: Dán; Kieu_Chan: *
R68 R70 = Tro 0805 1% 18k: Dán; Don_Vi: Con; So_Chan: 2; Ten_Linh_Kien: Trở 0805 1% 18k; Ma_Hang: MH005477; Chung_Loai: Dán; Kieu_Chan: *
R69 = Tro 0805 1% 12k: Dán; Don_Vi: Con; So_Chan: 2; Ten_Linh_Kien: Trở 0805 1% 12k; Ma_Hang: MH005475; Chung_Loai: Dán; Kieu_Chan: *

## Sheet WIFI.SchDoc
size A3; SheetNumber: 7; SheetTotal: 10
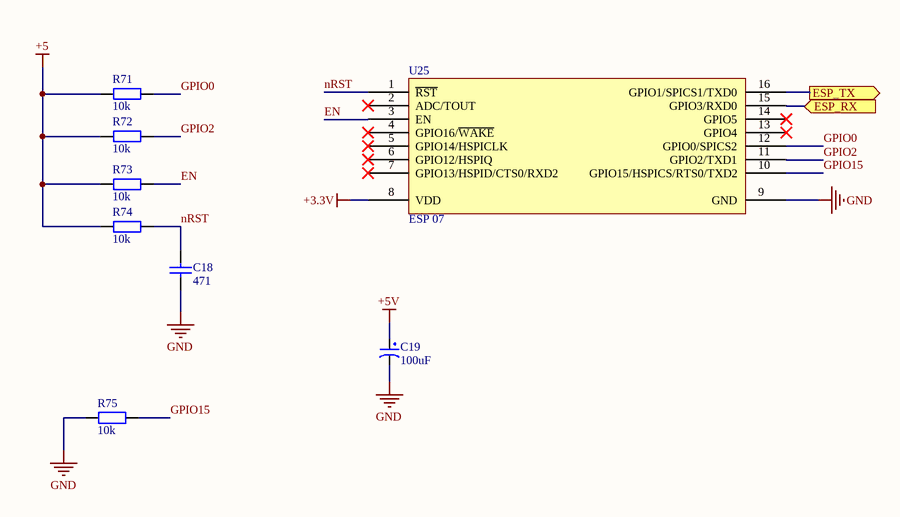
[diagram p7: WIFI.SchDoc]

### Parts
C18  471  [tu 0805]
C19  100uF  [tu hoa 5mm]
R71  10k  [tro smd 0805]
R72  10k  [tro smd 0805]
R73  10k  [tro smd 0805]
R74  10k  [tro smd 0805]
R75  10k  [tro smd 0805]
U25  ESP 07  [ESP8266 07]

### Ports
ESP_RX (in), ESP_TX (out)

### Nets
+3.3V: U25.8(VDD)
+5: R71.2 R72.2 R73.2 R74.2
+5V: C19.1
GND: C18.2 C19.2 R75.2 U25.9(GND)
EN: R73.1 U25.3(EN)
ESP_RX: U25.15(GPIO3/RXD0) ; port ESP_RX
ESP_TX: U25.16(GPIO1/SPICS1/TXD0) ; port ESP_TX
GPIO0: R71.1 U25.12(GPIO0/SPICS2)
GPIO2: R72.1 U25.11(GPIO2/TXD1)
GPIO15: R75.1 U25.10(GPIO15/HSPICS/RTS0/TXD2)
nRST: C18.1 R74.1 U25.1(~{RST})

Not connected (* = marked no-connect by the designer): U25 2(ADC/TOUT)* 4(GPIO16/~{WAKE})* 5(GPIO14/HSPICLK)* 6(GPIO12/HSPIQ)* 7(GPIO13/HSPID/CTS0/RXD2)* 13(GPIO4)* 14(GPIO5)*

### Library data of the parts
C18 = Tu 0805 471 50V 10%: Dán; Don_Vi: Con; So_Chan: 2; Ten_Linh_Kien: Tụ 0805 471-470 10% 50V; Ma_Hang: MH004564; Chung_Loai: Dán; Kieu_Chan: *
C19 = Tu Hoa 100uF 16V 5x7: as C13 on sheet A_INPUT; Chung_Loai: Cắm; Kieu_Chan: *
R71-R75 = Tro 0805 1% 10k: as R3 on sheet PLC_DIY; Chung_Loai: Dán; Kieu_Chan: *
U25 = ESP8266 07: ESP8266 07 16 Pin; IC: ESP8266-EX; Vendor: Ai-thinker

## Sheet PWM_OUTPUT.SchDoc
size A3; SheetNumber: 5; SheetTotal: 5

## Sheet KHOI_NGUON.SchDoc
size A3; SheetNumber: 10; SheetTotal: 10
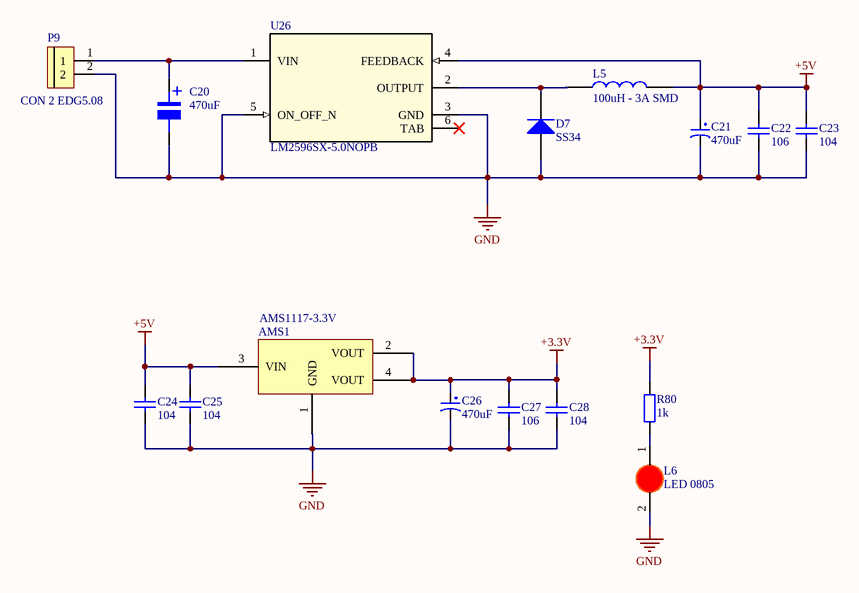
[diagram p8: KHOI_NGUON.SchDoc]

### Parts
AMS1  AMS1117-3.3V  [SOT223]
C20  470uF  [tu nhom 8 (f)]
C21  470uF  [tu hoa 8mm]
C22  106  [tu 0805]
C23  104  [tu 0805]
C24  104  [tu 0805]
C25  104  [tu 0805]
C26  470uF  [tu hoa 8mm]
C27  106  [tu 0805]
C28  104  [tu 0805]
D7  SS34  [DIODE SMA]
L5  100uH - 3A SMD  [Cuon Cam 12x12x10]
L6  LED 0805  [LED-0805-Red]
P9  CON 2 EDG5.08  [CON 2 2EDG5.08]
R80  1k  [tro smd 0805]
U26  LM2596SX-5.0NOPB  [KTT0005B]

### Nets
+3.3V: AMS1.2(VOUT) AMS1.4(VOUT) C26.1 C27.1 C28.1 R80.1
+5V: AMS1.3(VIN) C21.1 C22.1 C23.1 C24.1 C25.1 L5.2 U26.4(FEEDBACK)
GND: AMS1.1(GND) C20.2 C21.2 C22.2 C23.2 C24.2 C25.2 C26.2 C27.2 C28.2 D7.1(A) L6.2(K) P9.2 U26.3(GND) U26.5(ON_OFF_N)
NetC20_1: C20.1 P9.1 U26.1(VIN)
NetD7_2: D7.2(K) L5.1 U26.2(OUTPUT)
NetL6_1: L6.1(A) R80.2

Not connected (* = marked no-connect by the designer): U26 6(TAB)*

### Notes on the sheet
- (in symbol Tu Nhom 470uF 16V) +

### Library data of the parts
AMS1 = AMS1117 SMD: Dán; Value: AMS1117-3.3V SOT223; Don_Vi: Con; Ma_Hang: MH000596; Ghi_Chu: *; Kieu_Chan: *; Chung_Loai: Dán
C20 = Tu Nhom 470uF 16V: Dán; Don_Vi: Con; So_Chan: 2; Ten_Linh_Kien: Tụ Nhôm 470uF 16V 8x10.4MM; Ma_Hang: MH001940; Chung_Loai: Dán; Kieu_Chan: *
C21 C26 = Tu Hoa 470uF 16V 8x11: Cắm; Don_Vi: Con; So_Chan: 2; Ten_Linh_Kien: Tụ Hóa 470uF 16V 8x11MM; Ma_Hang: MH006550; Chung_Loai: Cắm; Kieu_Chan: *
C22 C27 = Tu 0805 106 16V 10%: Dán; Ten_Linh_Kien: Tụ 0805 106-10uF 10% 16V; So_Chan: 2; Don_Vi: Con; Ma_Hang: MH004553; Chung_Loai: Dán; Kieu_Chan: *
C23-C25 C28 = Tu 0805 104 50V 10%: as C1 on sheet PLC_DIY; Chung_Loai: Dán; Kieu_Chan: *
D7 = Diode SS34 ( 1N5822 ): Dán; Don_Vi: Con; Ma_Hang: MH002104; Ten_Linh_Kien: Diode SS34 3A 40V SMA ( 1N5822 SS34A); Kieu_Chan: *; Chung_Loai: Dán
L5 = CUON CAM 100uH SMD: Dán; Don_Vi: Con; Ma_Hang: MH003999; Ten_Linh_Kien: Cuộn Cảm 100uH 7x7x4MM CD74; Ma_Hang: *; Kieu_Chan: *; Chung_Loai: Dán
L6 = LED 0805 Do: as L2 on sheet PLC_DIY; Ghi_Chu: *; Kieu_Chan: *; Chung_Loai: Dán
P9 = CON 2 EDG5.08: as P4 on sheet A_INPUT; Ghi_Chu: *; Don_Vi: Con; Kieu_Chan: *; Chung_Loai: Cắm
R80 = Tro 0805 1% 1k: as R1 on sheet PLC_DIY; Chung_Loai: Dán; Kieu_Chan: *
U26 = LM2596SX-5.0NOPB: No Description Available; Mfr_Name: Texas Instruments; PartNumber: LM2596SX-ADJ/NOPB; Alternate_PartNumber: LM2596S-ADJ/NOPB; CompType: IC; TYPE: TYPE; RefDes: RefDes; PackageReference: KTT0005B; MountType: SMT; RoHS: Y; Manufacturer: Texas Instruments

## Nets that join several sheets
+3.3V: PLC_DIY (12 pins), A_INPUT (5 pins), D_INPUT (13 pins), A_OUTPUT (IC6.8), WIFI (U25.8), KHOI_NGUON (6 pins)
+5V: RS232 (C16.2 IC4.16), RS485 (R70.1), WIFI (C19.1), KHOI_NGUON (8 pins)
GND: PLC_DIY (22 pins), A_INPUT (18 pins), D_INPUT (13 pins), A_OUTPUT (IC6.4 P8.3 R76.1 R79.1), D_OUTPUT (10 pins), RS232 (5 pins), RS485 (IC5.5 P7.4 R68.2), WIFI (C18.2 C19.2 R75.2 U25.9), KHOI_NGUON (15 pins)
GND_OUT: D_INPUT (13 pins), D_OUTPUT (20 pins)
A_IN0: PLC_DIY (U1.15), A_INPUT (IC1.1 IC1.2)
A_IN1: PLC_DIY (U1.24), A_INPUT (IC1.6 IC1.7)
A_IN2: PLC_DIY (U1.31), A_INPUT (IC2.1 IC2.2)
A_IN3: PLC_DIY (U1.32), A_INPUT (IC2.6 IC2.7)
A_IN4: PLC_DIY (U1.36), A_INPUT (IC3.1 IC3.2)
A_IN5: PLC_DIY (U1.37), A_INPUT (IC3.6 IC3.7)
AOUT0: PLC_DIY (U1.29), A_OUTPUT (IC6.3)
AOUT1: PLC_DIY (U1.30), A_OUTPUT (IC6.5)
DE: PLC_DIY (U1.47 U1.48), RS485 (8 pins)
DI_0: PLC_DIY (U1.93), D_INPUT (R4.1 U2.4)
DI_1: PLC_DIY (U1.92), D_INPUT (R10.1 U5.4)
DI_2: PLC_DIY (U1.91), D_INPUT (R16.1 U8.4)
DI_3: PLC_DIY (U1.90), D_INPUT (R22.1 U11.4)
DI_4: PLC_DIY (U1.89), D_INPUT (R26.1 U13.4)
DI_5: PLC_DIY (U1.88), D_INPUT (R5.1 U3.4)
DI_6: PLC_DIY (U1.87), D_INPUT (R11.1 U6.4)
DI_7: PLC_DIY (U1.86), D_INPUT (R17.1 U9.4)
DI_8: PLC_DIY (U1.85), D_INPUT (R23.1 U12.4)
DI_9: PLC_DIY (U1.84), D_INPUT (R27.1 U14.4)
DI_10: PLC_DIY (U1.83), D_INPUT (R6.1 U4.4)
DI_11: PLC_DIY (U1.82), D_INPUT (R13.1 U7.4)
DI_12: PLC_DIY (U1.81), D_INPUT (R20.1 U10.4)
DO_0: PLC_DIY (U1.67), D_OUTPUT (U15.1)
DO_1: PLC_DIY (U1.66), D_OUTPUT (U18.1)
DO_2: PLC_DIY (U1.65), D_OUTPUT (U20.1)
DO_3: PLC_DIY (U1.64), D_OUTPUT (U22.1)
DO_4: PLC_DIY (U1.63), D_OUTPUT (U24.1)
DO_5: PLC_DIY (U1.62), D_OUTPUT (U16.1)
DO_6: PLC_DIY (U1.61), D_OUTPUT (U17.1)
DO_7: PLC_DIY (U1.60), D_OUTPUT (U19.1)
DO_8: PLC_DIY (U1.59), D_OUTPUT (U21.1)
DO_9: PLC_DIY (U1.58), D_OUTPUT (U23.1)
ESP_RX: PLC_DIY (U1.25), WIFI (U25.15)
ESP_TX: PLC_DIY (U1.26), WIFI (U25.16)
UART_RX: PLC_DIY (U1.68), RS232 (IC4.11)
UART_TX: PLC_DIY (U1.69), RS232 (IC4.12)